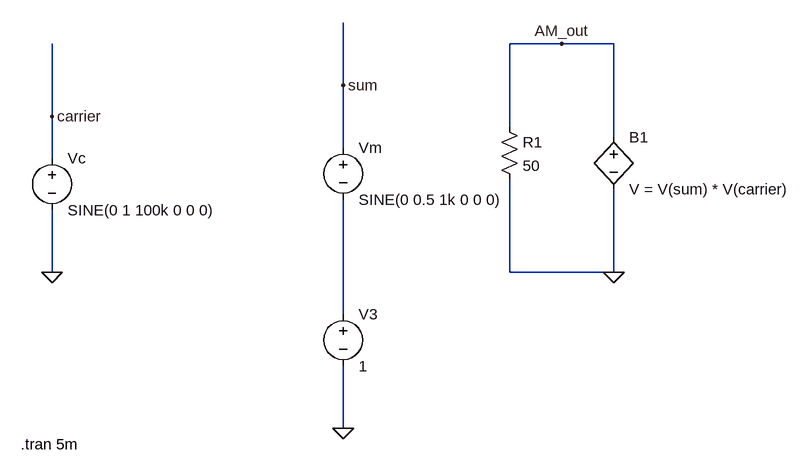
[diagram p0: schematic FTS_AM.asc]
FTS_AM.asc, the LTspice schematic file:
Version 4.1
SHEET 1 1588 808
WIRE 896 176 816 176
WIRE 976 176 896 176
WIRE 560 240 560 144
WIRE 112 288 112 176
WIRE 816 304 816 176
WIRE 976 320 976 176
WIRE 560 336 560 240
WIRE 112 352 112 288
WIRE 112 528 112 432
WIRE 816 528 816 384
WIRE 976 528 976 400
WIRE 976 528 816 528
WIRE 560 592 560 416
WIRE 560 768 560 672
FLAG 112 528 0
FLAG 112 288 carrier
FLAG 560 768 0
FLAG 560 240 sum
FLAG 976 528 0
FLAG 896 176 AM_out
SYMBOL voltage 112 336 R0
WINDOW 123 0 0 Left 0
WINDOW 39 0 0 Left 0
SYMATTR InstName Vc
SYMATTR Value SINE(0 1 100k 0 0 0)
SYMBOL voltage 560 320 R0
WINDOW 123 0 0 Left 0
WINDOW 39 0 0 Left 0
SYMATTR InstName Vm
SYMATTR Value SINE(0 0.5 1k 0 0 0)
SYMBOL voltage 560 576 R0
WINDOW 123 0 0 Left 0
WINDOW 39 0 0 Left 0
SYMATTR InstName V3
SYMATTR Value 1
SYMBOL bv 976 304 R0
SYMATTR InstName B1
SYMATTR Value V = V(sum) * V(carrier)
SYMBOL res 800 288 R0
SYMATTR InstName R1
SYMATTR Value 50
TEXT 64 792 Left 2 !.tran 5m

The netlist it stands for:
* FTS_AM.asc
Vc carrier 0 SINE(0 1 100k 0 0 0)
Vm sum N001 SINE(0 0.5 1k 0 0 0)
V3 N001 0 1
B1 AM_out 0 V = V(sum) * V(carrier)
R1 AM_out 0 50
.tran 5m
.backanno
.end